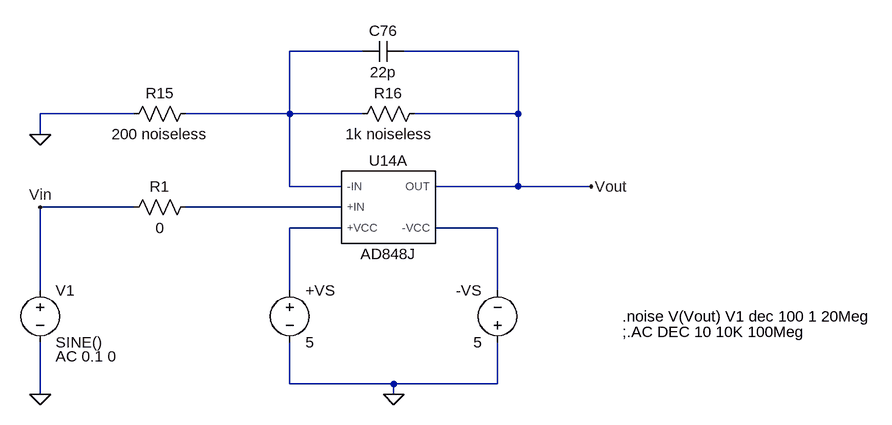
[diagram p0: schematic ad848j_test.asc]
ad848j_test.asc, the LTspice schematic file:
Version 4
SHEET 1 1196 680
WIRE 384 128 272 128
WIRE 624 128 448 128
WIRE 32 224 -112 224
WIRE 272 224 272 128
WIRE 272 224 112 224
WIRE 384 224 272 224
WIRE 624 224 624 128
WIRE 624 224 464 224
WIRE -112 256 -112 224
WIRE 272 336 272 224
WIRE 352 336 272 336
WIRE 624 336 624 224
WIRE 624 336 496 336
WIRE 736 336 624 336
WIRE 32 368 -112 368
WIRE 352 368 112 368
WIRE 352 400 272 400
WIRE 592 400 496 400
WIRE -112 496 -112 368
WIRE 272 496 272 400
WIRE 592 496 592 400
WIRE 272 640 272 576
WIRE 432 640 272 640
WIRE 592 640 592 576
WIRE 592 640 432 640
WIRE -112 656 -112 576
WIRE 432 656 432 640
FLAG 432 656 0
FLAG -112 656 0
FLAG -112 256 0
FLAG 736 336 Vout
FLAG -112 368 Vin
SYMBOL voltage 272 480 R0
SYMATTR InstName +VS
SYMATTR Value 5
SYMATTR SpiceLine Rser=0
SYMBOL voltage 592 592 R180
WINDOW 0 24 96 Left 2
WINDOW 3 24 16 Left 2
SYMATTR InstName -VS
SYMATTR Value 5
SYMATTR SpiceLine Rser=0
SYMBOL voltage -112 480 R0
WINDOW 123 24 118 Left 2
SYMATTR Value2 AC 0.1 0
SYMATTR InstName V1
SYMATTR Value SINE()
SYMBOL res 128 208 R90
WINDOW 0 0 56 VBottom 2
WINDOW 3 32 56 VTop 2
SYMATTR InstName R15
SYMATTR Value 200 noiseless
SYMBOL res 480 208 R90
WINDOW 0 0 56 VBottom 2
WINDOW 3 32 56 VTop 2
SYMATTR InstName R16
SYMATTR Value 1k noiseless
SYMBOL cap 448 112 R90
WINDOW 0 0 32 VBottom 2
WINDOW 3 32 32 VTop 2
SYMATTR InstName C76
SYMATTR Value 22p
SYMBOL AutoGenerated/AD848J 416 368 R0
SYMATTR InstName U14A
SYMBOL res 128 352 R90
WINDOW 0 0 56 VBottom 2
WINDOW 3 32 56 VTop 2
SYMATTR InstName R1
SYMATTR Value 0
TEXT 784 560 Left 2 !;.AC DEC 10 10K 100Meg
TEXT 784 536 Left 2 !.noise V(Vout) V1 dec 100 1 20Meg

The netlist it stands for:
* ad848j_test.asc
V§+VS N003 0 5 Rser=0
V§-VS 0 N004 5 Rser=0
V1 Vin 0 SINE() AC 0.1 0
R15 N001 0 200 noiseless
R16 Vout N001 1k noiseless
C76 Vout N001 22p
XU14A N002 N001 N003 N004 Vout AD848J  ; pins +IN -IN +VCC -VCC OUT
R1 N002 Vin 0
;.AC DEC 10 10K 100Meg
.noise V(Vout) V1 dec 100 1 20Meg
.lib /Users/shawn/Documents/GitHub/tdmspice/opamps/ad848j/ad848j.cir
.backanno
.end